# EAGLE design piezo-layer_v0.1-R002 (EAGLE 6.5.0)
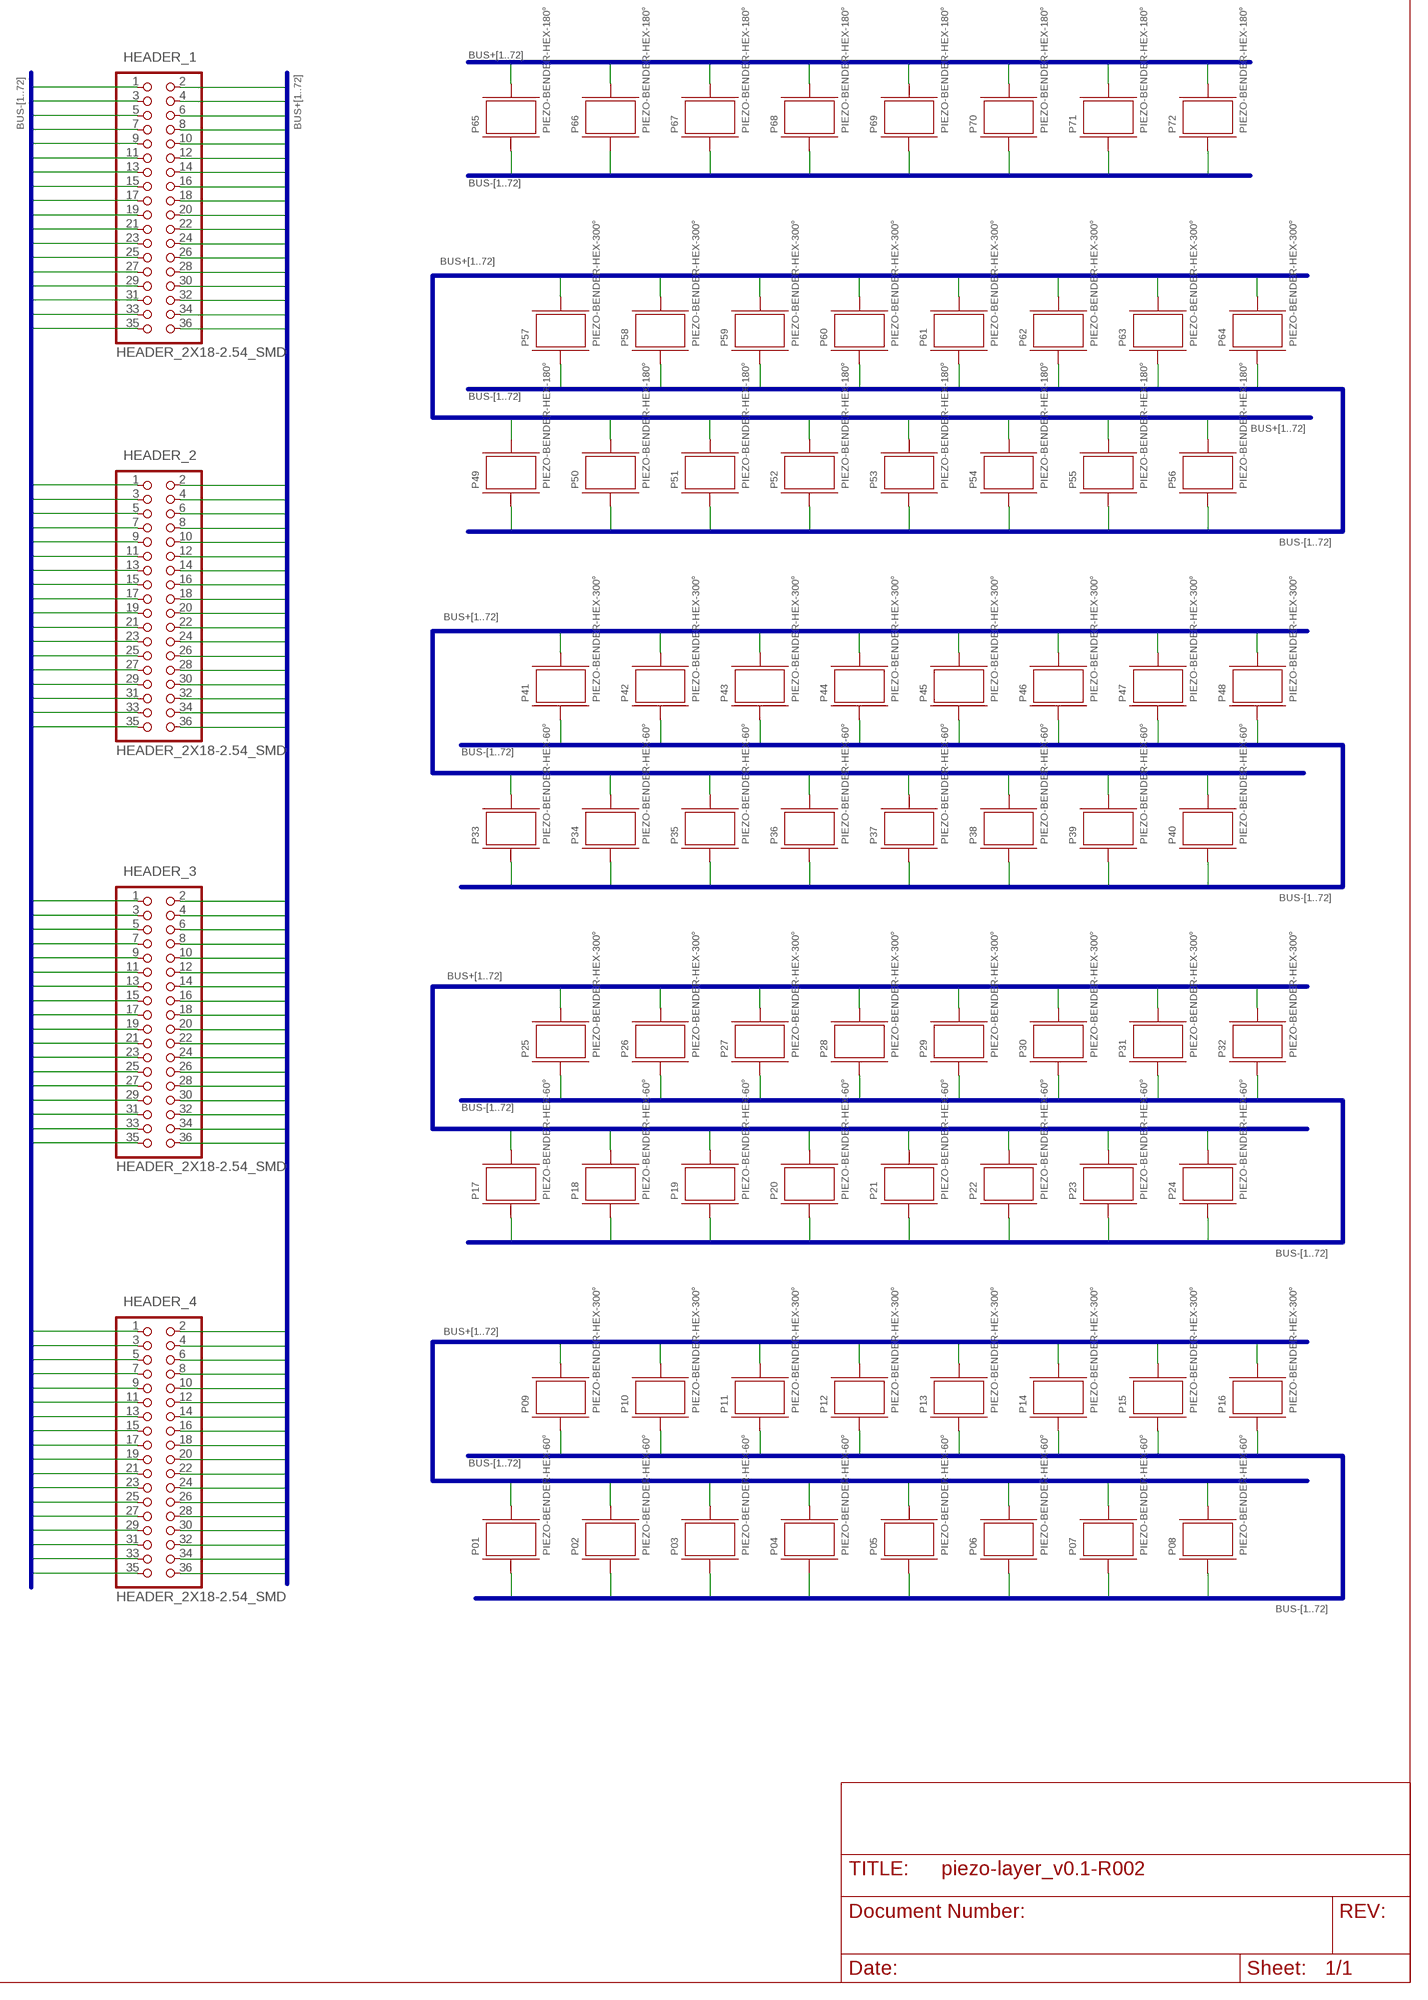
[diagram p0: schematic, sheet 1]

## Parts
HEADER_1  HEADER_2X18-2.54_SMD  [2X18_2.54_SMD]
HEADER_2  HEADER_2X18-2.54_SMD  [2X18_2.54_SMD]
HEADER_3  HEADER_2X18-2.54_SMD  [2X18_2.54_SMD]
HEADER_4  HEADER_2X18-2.54_SMD  [2X18_2.54_SMD]
P01  PIEZO-BENDER-HEX-60°  [PIEZO-BENDER-HEX_16MM_60°]
P02  PIEZO-BENDER-HEX-60°  [PIEZO-BENDER-HEX_16MM_60°]
P03  PIEZO-BENDER-HEX-60°  [PIEZO-BENDER-HEX_16MM_60°]
P04  PIEZO-BENDER-HEX-60°  [PIEZO-BENDER-HEX_16MM_60°]
P05  PIEZO-BENDER-HEX-60°  [PIEZO-BENDER-HEX_16MM_60°]
P06  PIEZO-BENDER-HEX-60°  [PIEZO-BENDER-HEX_16MM_60°]
P07  PIEZO-BENDER-HEX-60°  [PIEZO-BENDER-HEX_16MM_60°]
P08  PIEZO-BENDER-HEX-60°  [PIEZO-BENDER-HEX_16MM_60°]
P09  PIEZO-BENDER-HEX-300°  [PIEZO-BENDER-HEX_16MM_300°]
P10  PIEZO-BENDER-HEX-300°  [PIEZO-BENDER-HEX_16MM_300°]
P11  PIEZO-BENDER-HEX-300°  [PIEZO-BENDER-HEX_16MM_300°]
P12  PIEZO-BENDER-HEX-300°  [PIEZO-BENDER-HEX_16MM_300°]
P13  PIEZO-BENDER-HEX-300°  [PIEZO-BENDER-HEX_16MM_300°]
P14  PIEZO-BENDER-HEX-300°  [PIEZO-BENDER-HEX_16MM_300°]
P15  PIEZO-BENDER-HEX-300°  [PIEZO-BENDER-HEX_16MM_300°]
P16  PIEZO-BENDER-HEX-300°  [PIEZO-BENDER-HEX_16MM_300°]
P17  PIEZO-BENDER-HEX-60°  [PIEZO-BENDER-HEX_16MM_60°]
P18  PIEZO-BENDER-HEX-60°  [PIEZO-BENDER-HEX_16MM_60°]
P19  PIEZO-BENDER-HEX-60°  [PIEZO-BENDER-HEX_16MM_60°]
P20  PIEZO-BENDER-HEX-60°  [PIEZO-BENDER-HEX_16MM_60°]
P21  PIEZO-BENDER-HEX-60°  [PIEZO-BENDER-HEX_16MM_60°]
P22  PIEZO-BENDER-HEX-60°  [PIEZO-BENDER-HEX_16MM_60°]
P23  PIEZO-BENDER-HEX-60°  [PIEZO-BENDER-HEX_16MM_60°]
P24  PIEZO-BENDER-HEX-60°  [PIEZO-BENDER-HEX_16MM_60°]
P25  PIEZO-BENDER-HEX-300°  [PIEZO-BENDER-HEX_16MM_300°]
P26  PIEZO-BENDER-HEX-300°  [PIEZO-BENDER-HEX_16MM_300°]
P27  PIEZO-BENDER-HEX-300°  [PIEZO-BENDER-HEX_16MM_300°]
P28  PIEZO-BENDER-HEX-300°  [PIEZO-BENDER-HEX_16MM_300°]
P29  PIEZO-BENDER-HEX-300°  [PIEZO-BENDER-HEX_16MM_300°]
P30  PIEZO-BENDER-HEX-300°  [PIEZO-BENDER-HEX_16MM_300°]
P31  PIEZO-BENDER-HEX-300°  [PIEZO-BENDER-HEX_16MM_300°]
P32  PIEZO-BENDER-HEX-300°  [PIEZO-BENDER-HEX_16MM_300°]
P33  PIEZO-BENDER-HEX-60°  [PIEZO-BENDER-HEX_16MM_60°]
P34  PIEZO-BENDER-HEX-60°  [PIEZO-BENDER-HEX_16MM_60°]
P35  PIEZO-BENDER-HEX-60°  [PIEZO-BENDER-HEX_16MM_60°]
P36  PIEZO-BENDER-HEX-60°  [PIEZO-BENDER-HEX_16MM_60°]
P37  PIEZO-BENDER-HEX-60°  [PIEZO-BENDER-HEX_16MM_60°]
P38  PIEZO-BENDER-HEX-60°  [PIEZO-BENDER-HEX_16MM_60°]
P39  PIEZO-BENDER-HEX-60°  [PIEZO-BENDER-HEX_16MM_60°]
P40  PIEZO-BENDER-HEX-60°  [PIEZO-BENDER-HEX_16MM_60°]
P41  PIEZO-BENDER-HEX-300°  [PIEZO-BENDER-HEX_16MM_300°]
P42  PIEZO-BENDER-HEX-300°  [PIEZO-BENDER-HEX_16MM_300°]
P43  PIEZO-BENDER-HEX-300°  [PIEZO-BENDER-HEX_16MM_300°]
P44  PIEZO-BENDER-HEX-300°  [PIEZO-BENDER-HEX_16MM_300°]
P45  PIEZO-BENDER-HEX-300°  [PIEZO-BENDER-HEX_16MM_300°]
P46  PIEZO-BENDER-HEX-300°  [PIEZO-BENDER-HEX_16MM_300°]
P47  PIEZO-BENDER-HEX-300°  [PIEZO-BENDER-HEX_16MM_300°]
P48  PIEZO-BENDER-HEX-300°  [PIEZO-BENDER-HEX_16MM_300°]
P49  PIEZO-BENDER-HEX-180°  [PIEZO-BENDER-HEX_16MM_180°]
P50  PIEZO-BENDER-HEX-180°  [PIEZO-BENDER-HEX_16MM_180°]
P51  PIEZO-BENDER-HEX-180°  [PIEZO-BENDER-HEX_16MM_180°]
P52  PIEZO-BENDER-HEX-180°  [PIEZO-BENDER-HEX_16MM_180°]
P53  PIEZO-BENDER-HEX-180°  [PIEZO-BENDER-HEX_16MM_180°]
P54  PIEZO-BENDER-HEX-180°  [PIEZO-BENDER-HEX_16MM_180°]
P55  PIEZO-BENDER-HEX-180°  [PIEZO-BENDER-HEX_16MM_180°]
P56  PIEZO-BENDER-HEX-180°  [PIEZO-BENDER-HEX_16MM_180°]
P57  PIEZO-BENDER-HEX-300°  [PIEZO-BENDER-HEX_16MM_300°]
P58  PIEZO-BENDER-HEX-300°  [PIEZO-BENDER-HEX_16MM_300°]
P59  PIEZO-BENDER-HEX-300°  [PIEZO-BENDER-HEX_16MM_300°]
P60  PIEZO-BENDER-HEX-300°  [PIEZO-BENDER-HEX_16MM_300°]
P61  PIEZO-BENDER-HEX-300°  [PIEZO-BENDER-HEX_16MM_300°]
P62  PIEZO-BENDER-HEX-300°  [PIEZO-BENDER-HEX_16MM_300°]
P63  PIEZO-BENDER-HEX-300°  [PIEZO-BENDER-HEX_16MM_300°]
P64  PIEZO-BENDER-HEX-300°  [PIEZO-BENDER-HEX_16MM_300°]
P65  PIEZO-BENDER-HEX-180°  [PIEZO-BENDER-HEX_16MM_180°]
P66  PIEZO-BENDER-HEX-180°  [PIEZO-BENDER-HEX_16MM_180°]
P67  PIEZO-BENDER-HEX-180°  [PIEZO-BENDER-HEX_16MM_180°]
P68  PIEZO-BENDER-HEX-180°  [PIEZO-BENDER-HEX_16MM_180°]
P69  PIEZO-BENDER-HEX-180°  [PIEZO-BENDER-HEX_16MM_180°]
P70  PIEZO-BENDER-HEX-180°  [PIEZO-BENDER-HEX_16MM_180°]
P71  PIEZO-BENDER-HEX-180°  [PIEZO-BENDER-HEX_16MM_180°]
P72  PIEZO-BENDER-HEX-180°  [PIEZO-BENDER-HEX_16MM_180°]

## Nets
BUS+1: HEADER_1.18 P01.TIP1(+_1)
BUS+2: HEADER_1.36 P02.TIP1(+_1)
BUS+3: HEADER_2.18 P03.TIP1(+_1)
BUS+4: HEADER_2.36 P04.TIP1(+_1)
BUS+5: HEADER_3.18 P05.TIP1(+_1)
BUS+6: HEADER_3.36 P06.TIP1(+_1)
BUS+7: HEADER_4.18 P07.TIP1(+_1)
BUS+8: HEADER_4.36 P08.TIP1(+_1)
BUS+9: HEADER_1.16 P09.TIP1(+_1)
BUS+10: HEADER_1.34 P10.TIP1(+_1)
BUS+11: HEADER_2.16 P11.TIP1(+_1)
BUS+12: HEADER_2.34 P12.TIP1(+_1)
BUS+13: HEADER_3.16 P13.TIP1(+_1)
BUS+14: HEADER_3.34 P14.TIP1(+_1)
BUS+15: HEADER_4.16 P15.TIP1(+_1)
BUS+16: HEADER_4.34 P16.TIP1(+_1)
BUS+17: HEADER_1.14 P17.TIP1(+_1)
BUS+18: HEADER_1.32 P18.TIP1(+_1)
BUS+19: HEADER_2.14 P19.TIP1(+_1)
BUS+20: HEADER_2.32 P20.TIP1(+_1)
BUS+21: HEADER_3.14 P21.TIP1(+_1)
BUS+22: HEADER_3.32 P22.TIP1(+_1)
BUS+23: HEADER_4.14 P23.TIP1(+_1)
BUS+24: HEADER_4.32 P24.TIP1(+_1)
BUS+25: HEADER_1.12 P25.TIP1(+_1)
BUS+26: HEADER_1.30 P26.TIP1(+_1)
BUS+27: HEADER_2.12 P27.TIP1(+_1)
BUS+28: HEADER_2.30 P28.TIP1(+_1)
BUS+29: HEADER_3.12 P29.TIP1(+_1)
BUS+30: HEADER_3.30 P30.TIP1(+_1)
BUS+31: HEADER_4.12 P31.TIP1(+_1)
BUS+32: HEADER_4.30 P32.TIP1(+_1)
BUS+33: HEADER_1.10 P33.TIP1(+_1)
BUS+34: HEADER_1.28 P34.TIP1(+_1)
BUS+35: HEADER_2.10 P35.TIP1(+_1)
BUS+36: HEADER_2.28 P36.TIP1(+_1)
BUS+37: HEADER_3.10 P37.TIP1(+_1)
BUS+38: HEADER_3.28 P38.TIP1(+_1)
BUS+39: HEADER_4.10 P39.TIP1(+_1)
BUS+40: HEADER_4.28 P40.TIP1(+_1)
BUS+41: HEADER_1.8 P41.TIP1(+_1)
BUS+42: HEADER_1.26 P42.TIP1(+_1)
BUS+43: HEADER_2.8 P43.TIP1(+_1)
BUS+44: HEADER_2.26 P44.TIP1(+_1)
BUS+45: HEADER_3.8 P45.TIP1(+_1)
BUS+46: HEADER_3.26 P46.TIP1(+_1)
BUS+47: HEADER_4.8 P47.TIP1(+_1)
BUS+48: HEADER_4.26 P48.TIP1(+_1)
BUS+49: HEADER_1.6 P49.TIP1(+_1)
BUS+50: HEADER_1.24 P50.TIP1(+_1)
BUS+51: HEADER_2.6 P51.TIP1(+_1)
BUS+52: HEADER_2.24 P52.TIP1(+_1)
BUS+53: HEADER_3.6 P53.TIP1(+_1)
BUS+54: HEADER_3.24 P54.TIP1(+_1)
BUS+55: HEADER_4.6 P55.TIP1(+_1)
BUS+56: HEADER_4.24 P56.TIP1(+_1)
BUS+57: HEADER_1.4 P57.TIP1(+_1)
BUS+58: HEADER_1.22 P58.TIP1(+_1)
BUS+59: HEADER_2.4 P59.TIP1(+_1)
BUS+60: HEADER_2.22 P60.TIP1(+_1)
BUS+61: HEADER_3.4 P61.TIP1(+_1)
BUS+62: HEADER_3.22 P62.TIP1(+_1)
BUS+63: HEADER_4.4 P63.TIP1(+_1)
BUS+64: HEADER_4.22 P64.TIP1(+_1)
BUS+65: HEADER_1.2 P65.TIP1(+_1)
BUS+66: HEADER_1.20 P66.TIP1(+_1)
BUS+67: HEADER_2.2 P67.TIP1(+_1)
BUS+68: HEADER_2.20 P68.TIP1(+_1)
BUS+69: HEADER_3.2 P69.TIP1(+_1)
BUS+70: HEADER_3.20 P70.TIP1(+_1)
BUS+71: HEADER_4.2 P71.TIP1(+_1)
BUS+72: HEADER_4.20 P72.TIP1(+_1)
BUS-1: HEADER_1.17 P01.PAD1(-_1)
BUS-2: HEADER_1.35 P02.PAD1(-_1)
BUS-3: HEADER_2.17 P03.PAD1(-_1)
BUS-4: HEADER_2.35 P04.PAD1(-_1)
BUS-5: HEADER_3.17 P05.PAD1(-_1)
BUS-6: HEADER_3.35 P06.PAD1(-_1)
BUS-7: HEADER_4.17 P07.PAD1(-_1)
BUS-8: HEADER_4.35 P08.PAD1(-_1)
BUS-9: HEADER_1.15 P09.PAD1(-_1)
BUS-10: HEADER_1.33 P10.PAD1(-_1)
BUS-11: HEADER_2.15 P11.PAD1(-_1)
BUS-12: HEADER_2.33 P12.PAD1(-_1)
BUS-13: HEADER_3.15 P13.PAD1(-_1)
BUS-14: HEADER_3.33 P14.PAD1(-_1)
BUS-15: HEADER_4.15 P15.PAD1(-_1)
BUS-16: HEADER_4.33 P16.PAD1(-_1)
BUS-17: HEADER_1.13 P17.PAD1(-_1)
BUS-18: HEADER_1.31 P18.PAD1(-_1)
BUS-19: HEADER_2.13 P19.PAD1(-_1)
BUS-20: HEADER_2.31 P20.PAD1(-_1)
BUS-21: HEADER_3.13 P21.PAD1(-_1)
BUS-22: HEADER_3.31 P22.PAD1(-_1)
BUS-23: HEADER_4.13 P23.PAD1(-_1)
BUS-24: HEADER_4.31 P24.PAD1(-_1)
BUS-25: HEADER_1.11 P25.PAD1(-_1)
BUS-26: HEADER_1.29 P26.PAD1(-_1)
BUS-27: HEADER_2.11 P27.PAD1(-_1)
BUS-28: HEADER_2.29 P28.PAD1(-_1)
BUS-29: HEADER_3.11 P29.PAD1(-_1)
BUS-30: HEADER_3.29 P30.PAD1(-_1)
BUS-31: HEADER_4.11 P31.PAD1(-_1)
BUS-32: HEADER_4.29 P32.PAD1(-_1)
BUS-33: HEADER_1.9 P33.PAD1(-_1)
BUS-34: HEADER_1.27 P34.PAD1(-_1)
BUS-35: HEADER_2.9 P35.PAD1(-_1)
BUS-36: HEADER_2.27 P36.PAD1(-_1)
BUS-37: HEADER_3.9 P37.PAD1(-_1)
BUS-38: HEADER_3.27 P38.PAD1(-_1)
BUS-39: HEADER_4.9 P39.PAD1(-_1)
BUS-40: HEADER_4.27 P40.PAD1(-_1)
BUS-41: HEADER_1.7 P41.PAD1(-_1)
BUS-42: HEADER_1.25 P42.PAD1(-_1)
BUS-43: HEADER_2.7 P43.PAD1(-_1)
BUS-44: HEADER_2.25 P44.PAD1(-_1)
BUS-45: HEADER_3.7 P45.PAD1(-_1)
BUS-46: HEADER_3.25 P46.PAD1(-_1)
BUS-47: HEADER_4.7 P47.PAD1(-_1)
BUS-48: HEADER_4.25 P48.PAD1(-_1)
BUS-49: HEADER_1.5 P49.PAD1(-_1)
BUS-50: HEADER_1.23 P50.PAD1(-_1)
BUS-51: HEADER_2.5 P51.PAD1(-_1)
BUS-52: HEADER_2.23 P52.PAD1(-_1)
BUS-53: HEADER_3.5 P53.PAD1(-_1)
BUS-54: HEADER_3.23 P54.PAD1(-_1)
BUS-55: HEADER_4.5 P55.PAD1(-_1)
BUS-56: HEADER_4.23 P56.PAD1(-_1)
BUS-57: HEADER_1.3 P57.PAD1(-_1)
BUS-58: HEADER_1.21 P58.PAD1(-_1)
BUS-59: HEADER_2.3 P59.PAD1(-_1)
BUS-60: HEADER_2.21 P60.PAD1(-_1)
BUS-61: HEADER_3.3 P61.PAD1(-_1)
BUS-62: HEADER_3.21 P62.PAD1(-_1)
BUS-63: HEADER_4.3 P63.PAD1(-_1)
BUS-64: HEADER_4.21 P64.PAD1(-_1)
BUS-65: HEADER_1.1 P65.PAD1(-_1)
BUS-66: HEADER_1.19 P66.PAD1(-_1)
BUS-67: HEADER_2.1 P67.PAD1(-_1)
BUS-68: HEADER_2.19 P68.PAD1(-_1)
BUS-69: HEADER_3.1 P69.PAD1(-_1)
BUS-70: HEADER_3.19 P70.PAD1(-_1)
BUS-71: HEADER_4.1 P71.PAD1(-_1)
BUS-72: HEADER_4.19 P72.PAD1(-_1)

## Buses
BUS+[1..72]
BUS-[1..72]

## Library data of the parts
HEADER_1-HEADER_4 = SABRe:HEADER_2X18
P01-P09 P10-P72 = ICST:PIEZO-BENDER-HEX

## Board
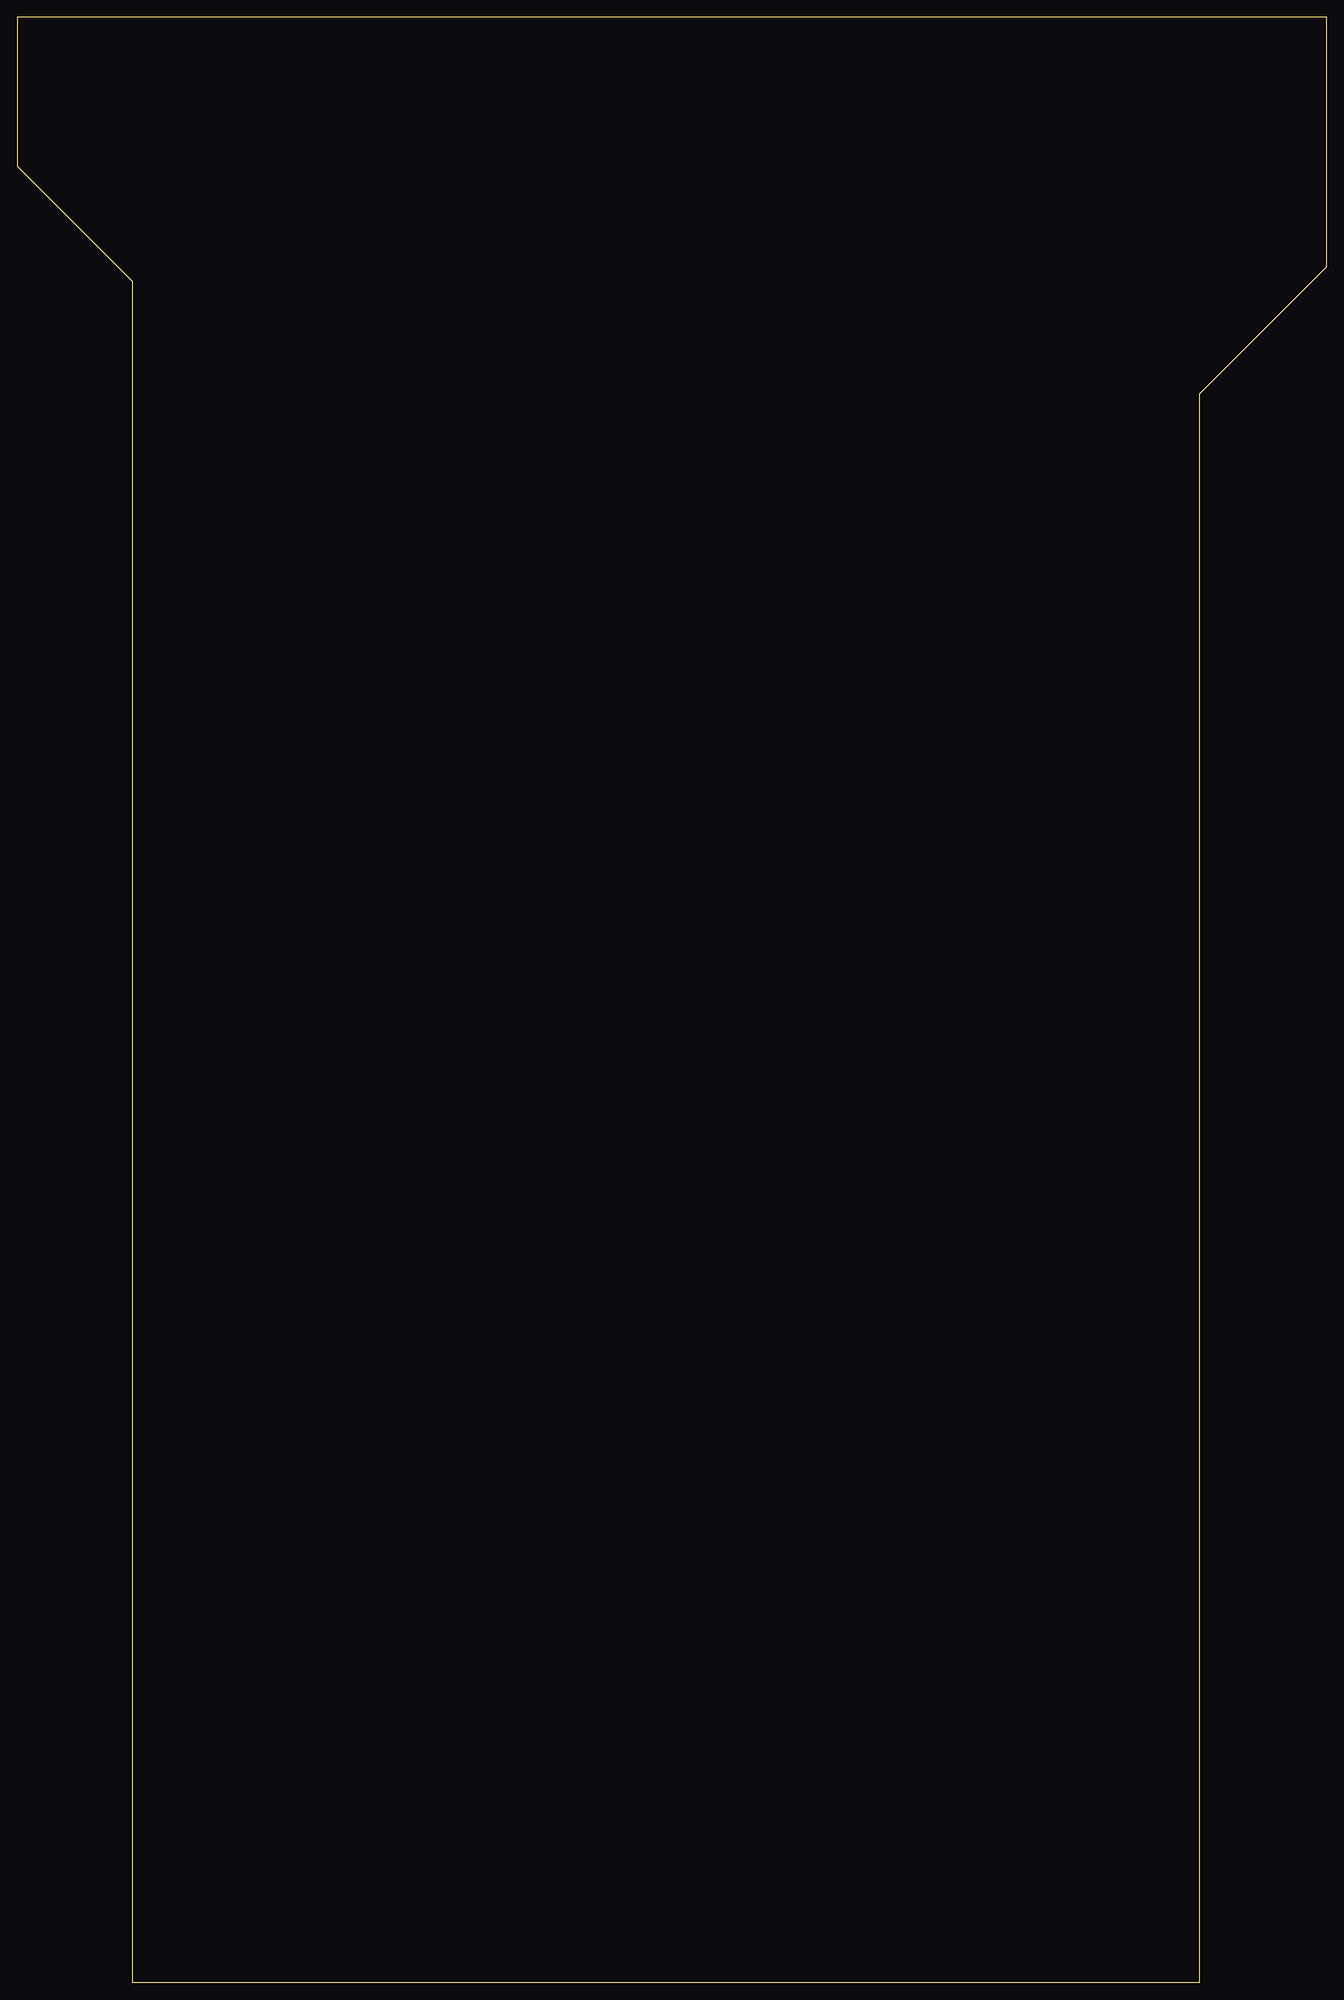
[diagram p1: board, top side]
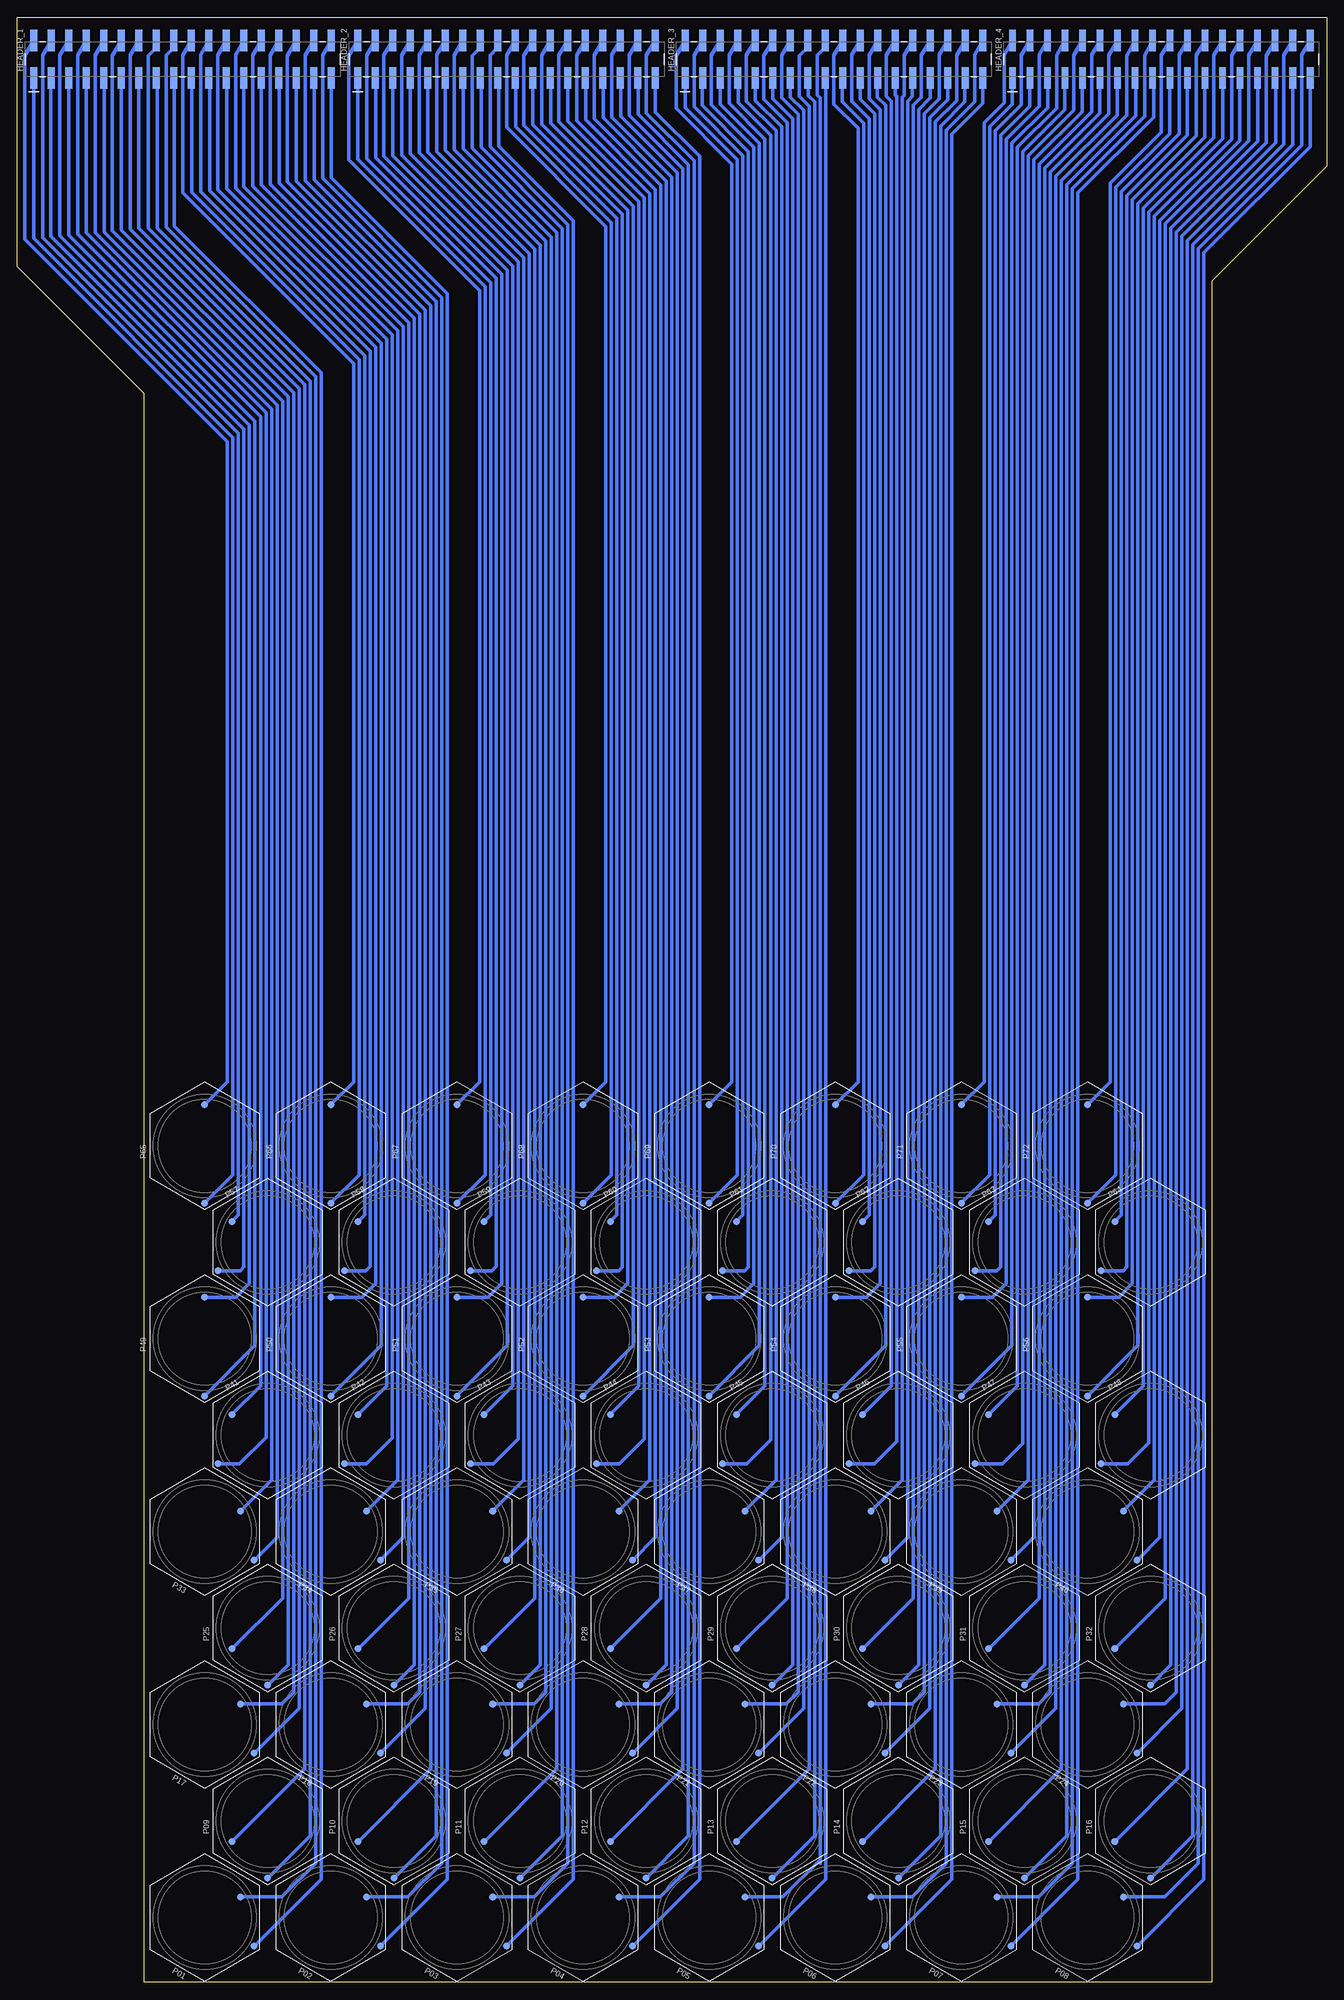
[diagram p2: board, bottom side, seen from below]

Size 190 x 285.2 mm. Coordinates in mm from the lower left corner, seen from the top.
Outline: 16.7,0 171.6,0 171.6,230.6 190,249 190,285.2 0,285.2 0,263.6 16.7,246.9 16.7,0
Copper layers 16: Bottom 0.035mm
Design rules "1L-0.2-0.15_0.3mm *": minimum track width 0.2mm, minimum drill 0.3mm, track to track 0.15mm, track to pad 0.15mm, pad to pad 0.15mm, via to via 0.15mm, smd to smd 0.15mm, copper to edge 0.5mm, drill to drill 1mm, minimum pad ring 10mil, minimum via ring 8mil, stop-mask expansion 4mil, vias tented up to drill 0mil, thermal gap 10mil

### Footprints (pad centres in the part's own frame; a part is rotated, then mirrored left to right if it is on the bottom)
2X18_2.54_SMD = smd 1 x 3.1: 1 -21.59,-2.7; 2 -21.59,2.7; 3 -19.05,-2.7; 4 -19.05,2.7; 5 -16.51,-2.7; 6 -16.51,2.7; 7 -13.97,-2.7; 8 -13.97,2.7; 9 -11.43,-2.7; 10 -11.43,2.7; 11 -8.89,-2.7; 12 -8.89,2.7; 13 -6.35,-2.7; 14 -6.35,2.7; 15 -3.81,-2.7; 16 -3.81,2.7; 17 -1.27,-2.7; 18 -1.27,2.7; 19 1.27,-2.7; 20 1.27,2.7; 21 3.81,-2.7; 22 3.81,2.7; 23 6.35,-2.7; 24 6.35,2.7; 25 8.89,-2.7; 26 8.89,2.7; 27 11.43,-2.7; 28 11.43,2.7; 29 13.97,-2.7; 30 13.97,2.7; 31 16.51,-2.7; 32 16.51,2.7; 33 19.05,-2.7; 34 19.05,2.7; 35 21.59,-2.7; 36 21.59,2.7
PIEZO-BENDER-HEX_16MM_60° = smd 1 x 1: PAD1 -8.3,0; TIP1 -3,-5.2
PIEZO-BENDER-HEX_16MM_300° = smd 1 x 1: PAD1 -8.3,0; TIP1 -3,5.2
PIEZO-BENDER-HEX_16MM_180° = smd 1 x 1: PAD1 -8.3,0; TIP1 6,0

### Placement (x,y rotation side)
HEADER_1  166,279.1 0 bottom
HEADER_2  119,279.1 0 bottom
HEADER_3  71.5,279.1 0 bottom
HEADER_4  24,279.1 0 bottom
P01  162.8,9.4 150 bottom
P02  144.5,9.4 150 bottom
P03  126.2,9.4 150 bottom
P04  107.9,9.4 150 bottom
P05  89.6,9.4 150 bottom
P06  71.3,9.4 150 bottom
P07  53,9.4 150 bottom
P08  34.7,9.4 150 bottom
P09  153.65,23.4 90 bottom
P10  135.35,23.4 90 bottom
P11  117.05,23.4 90 bottom
P12  98.75,23.4 90 bottom
P13  80.45,23.4 90 bottom
P14  62.15,23.4 90 bottom
P15  43.85,23.4 90 bottom
P16  25.55,23.4 90 bottom
P17  162.8,37.4 150 bottom
P18  144.5,37.4 150 bottom
P19  126.2,37.4 150 bottom
P20  107.9,37.4 150 bottom
P21  89.6,37.4 150 bottom
P22  71.3,37.4 150 bottom
P23  53,37.4 150 bottom
P24  34.7,37.4 150 bottom
P25  153.65,51.4 90 bottom
P26  135.35,51.4 90 bottom
P27  117.05,51.4 90 bottom
P28  98.75,51.4 90 bottom
P29  80.45,51.4 90 bottom
P30  62.15,51.4 90 bottom
P31  43.85,51.4 90 bottom
P32  25.55,51.4 90 bottom
P33  162.8,65.4 150 bottom
P34  144.5,65.4 150 bottom
P35  126.2,65.4 150 bottom
P36  107.9,65.4 150 bottom
P37  89.6,65.4 150 bottom
P38  71.3,65.4 150 bottom
P39  53,65.4 150 bottom
P40  34.7,65.4 150 bottom
P41  153.65,79.4 30 bottom
P42  135.35,79.4 30 bottom
P43  117.05,79.4 30 bottom
P44  98.75,79.4 30 bottom
P45  80.45,79.4 30 bottom
P46  62.15,79.4 30 bottom
P47  43.85,79.4 30 bottom
P48  25.55,79.4 30 bottom
P49  162.8,93.4 90 bottom
P50  144.5,93.4 90 bottom
P51  126.2,93.4 90 bottom
P52  107.9,93.4 90 bottom
P53  89.6,93.4 90 bottom
P54  71.3,93.4 90 bottom
P55  53,93.4 90 bottom
P56  34.7,93.4 90 bottom
P57  153.65,107.4 30 bottom
P58  135.35,107.4 30 bottom
P59  117.05,107.4 30 bottom
P60  98.75,107.4 30 bottom
P61  80.45,107.4 30 bottom
P62  62.15,107.4 30 bottom
P63  43.85,107.4 30 bottom
P64  25.55,107.4 30 bottom
P65  162.8,121.4 90 bottom
P66  144.5,121.4 90 bottom
P67  126.2,121.4 90 bottom
P68  107.9,121.4 90 bottom
P69  89.6,121.4 90 bottom
P70  71.3,121.4 90 bottom
P71  53,121.4 90 bottom
P72  34.7,121.4 90 bottom

### Tracks (layer width: path | path; a pad name or v marks a point on that pad's centre or on a via)
BUS+1
  Bottom 0.5: 167.14,280.94 167.24,280.84 | 167.24,280.84 168.4,279.68 168.4,254.7 146.7,233 146.7,17.3 151.6,12.4 P01.TIP1 | HEADER_1.18 167.24,280.91 167.24,280.84
BUS+2
  Bottom 0.5: HEADER_1.36 145.7,279.65 145.7,261.8 128.4,244.5 128.4,17.3 133.3,12.4 P02.TIP1
BUS+3
  Bottom 0.5: 120.14,280.94 120.24,280.84 | 120.24,280.84 121.4,279.68 121.4,266.4 110.1,255.1 110.1,17.3 115,12.4 P03.TIP1 | HEADER_2.18 120.24,280.91 120.24,280.84
BUS+4
  Bottom 0.5: HEADER_2.36 98.7,279.65 98.7,271.3 91.8,264.4 91.8,17.3 96.7,12.4 P04.TIP1
BUS+5
  Bottom 0.5: 72.64,280.94 72.69,280.89 | 72.69,280.89 73.9,279.68 73.9,273.9 73.5,273.5 73.5,17.8 | HEADER_3.18 72.72,280.89 72.69,280.89 | 73.5,17.8 73.5,17.3 | P05.TIP1 78.9,12.4 73.5,17.8
BUS+6
  Bottom 0.5: HEADER_3.36 51.1,279.75 51.1,272.9 55.2,268.8 55.2,17.3 60.1,12.4 P06.TIP1
BUS+7
  Bottom 0.5: HEADER_4.18 26.4,279.68 26.4,270.8 36.9,260.3 36.9,17.3 41.8,12.4 P07.TIP1
BUS+8
  Bottom 0.5: HEADER_4.36 3.6,279.75 3.6,266.6 18.6,251.6 18.6,17.3 23.5,12.4 P08.TIP1
BUS+9
  Bottom 0.5: HEADER_1.16 169.68,280.94 171,279.62 171,254.6 148.3,231.9 148.3,30.95 P09.TIP1
BUS+10
  Bottom 0.5: HEADER_1.34 148.2,279.69 148.2,261.5 130,243.3 130,30.95 P10.TIP1
BUS+11
  Bottom 0.5: HEADER_2.16 122.68,280.94 124,279.62 124,266.2 111.7,253.9 111.7,30.95 P11.TIP1
BUS+12
  Bottom 0.5: HEADER_2.34 101.2,279.69 101.2,271 93.4,263.2 93.4,30.95 P12.TIP1
BUS+13
  Bottom 0.5: HEADER_3.16 75.18,280.94 76.5,279.62 76.5,273.7 75.1,272.3 75.1,30.95 P13.TIP1
BUS+14
  Bottom 0.5: HEADER_3.34 53.7,279.69 53.7,273.1 56.8,270 56.8,30.95 P14.TIP1
BUS+15
  Bottom 0.5: HEADER_4.16 29,279.62 29,271 38.5,261.5 38.5,30.95 P15.TIP1
BUS+16
  Bottom 0.5: HEADER_4.34 6.2,279.69 6.2,266.8 20.2,252.8 20.2,30.95 P16.TIP1
BUS+17
  Bottom 0.5: HEADER_1.14 173.6,279.69 173.6,254.4 149.9,230.7 149.9,42.1 151.6,40.4 P17.TIP1
BUS+18
  Bottom 0.5: HEADER_1.32 150.8,279.63 150.8,261.3 131.6,242.1 131.6,42.1 133.3,40.4 P18.TIP1
BUS+19
  Bottom 0.5: HEADER_2.14 126.6,279.69 126.6,266 113.3,252.7 113.3,42.1 115,40.4 P19.TIP1
BUS+20
  Bottom 0.5: HEADER_2.32 103.7,279.73 103.7,270.7 95,262 95,42.1 96.7,40.4 P20.TIP1
BUS+21
  Bottom 0.5: HEADER_3.14 79.1,279.69 79.1,273.5 76.7,271.1 76.7,42.1 78.4,40.4 P21.TIP1
BUS+22
  Bottom 0.5: HEADER_3.32 56.2,279.73 56.2,273.4 58.4,271.2 58.4,42.1 60.1,40.4 P22.TIP1
BUS+23
  Bottom 0.5: HEADER_4.14 31.6,279.69 31.6,271.2 40.1,262.7 40.1,42.1 41.8,40.4 P23.TIP1
BUS+24
  Bottom 0.5: HEADER_4.32 8.8,279.63 8.8,267 21.8,254 21.8,42.1 23.5,40.4 P24.TIP1
BUS+25
  Bottom 0.5: HEADER_1.12 176.2,279.63 176.2,254.2 151.5,229.5 151.5,55.75 P25.TIP1
BUS+26
  Bottom 0.5: HEADER_1.30 153.3,279.67 153.3,261 133.2,240.9 133.2,55.75 P26.TIP1
BUS+27
  Bottom 0.5: HEADER_2.12 129.1,279.73 129.1,265.7 114.9,251.5 114.9,55.75 P27.TIP1
BUS+28
  Bottom 0.5: HEADER_2.30 106.3,279.67 106.3,270.5 96.6,260.8 96.6,55.75 P28.TIP1
BUS+29
  Bottom 0.5: HEADER_3.12 81.7,279.63 81.7,273.3 78.3,269.9 78.3,55.75 P29.TIP1
BUS+30
  Bottom 0.5: HEADER_3.30 58.8,279.67 58.8,273.6 60,272.4 60,55.75 P30.TIP1
BUS+31
  Bottom 0.5: HEADER_4.12 34.1,279.73 34.1,271.5 41.7,263.9 41.7,55.75 P31.TIP1
BUS+32
  Bottom 0.5: HEADER_4.30 11.3,279.67 11.3,267.3 23.4,255.2 23.4,55.75 P32.TIP1
BUS+33
  Bottom 0.5: HEADER_1.10 178.7,279.67 178.7,253.9 153.1,228.3 153.1,72.91 P33.TIP1
BUS+34
  Bottom 0.5: HEADER_1.28 155.8,279.71 155.8,260.7 134.8,239.7 134.8,72.91 P34.TIP1
BUS+35
  Bottom 0.5: HEADER_2.10 131.7,279.67 131.7,265.5 116.5,250.3 116.5,72.91 P35.TIP1
BUS+36
  Bottom 0.5: HEADER_2.28 108.8,279.71 108.8,270.2 98.2,259.6 98.2,72.91 P36.TIP1
BUS+37
  Bottom 0.5: HEADER_3.10 84.2,279.67 84.2,273 79.9,268.7 79.9,72.91 P37.TIP1
BUS+38
  Bottom 0.5: HEADER_3.28 61.3,279.71 61.3,273.9 61.6,273.6 61.6,72.91 P38.TIP1
BUS+39
  Bottom 0.5: HEADER_4.10 36.7,279.67 36.7,271.7 43.3,265.1 43.3,72.91 P39.TIP1
BUS+40
  Bottom 0.5: HEADER_4.28 13.8,279.71 13.8,267.5 25,256.3 25,72.91 P40.TIP1
BUS+41
  Bottom 0.5: HEADER_1.8 181.2,279.71 181.2,253.7 154.7,227.2 154.7,86.55 P41.TIP1
BUS+42
  Bottom 0.5: HEADER_1.26 158.3,279.75 158.3,260.4 136.4,238.5 136.4,86.55 P42.TIP1
BUS+43
  Bottom 0.5: HEADER_2.8 134.2,279.71 134.2,265.2 118.1,249.1 118.1,86.55 P43.TIP1
BUS+44
  Bottom 0.5: HEADER_2.26 111.4,279.65 111.4,270 99.8,258.4 99.8,86.55 P44.TIP1
BUS+45
  Bottom 0.5: HEADER_3.8 86.7,279.71 86.7,272.7 81.5,267.5 81.5,86.55 P45.TIP1
BUS+46
  Bottom 0.5: HEADER_3.26 63.9,279.65 63.9,273.7 63.2,273 63.2,86.55 P46.TIP1
BUS+47
  Bottom 0.5: HEADER_4.8 39.2,279.71 39.2,272 44.9,266.3 44.9,86.55 P47.TIP1
BUS+48
  Bottom 0.5: HEADER_4.26 16.4,279.65 16.4,267.7 26.6,257.5 26.6,86.55 P48.TIP1
BUS+49
  Bottom 0.5: HEADER_1.6 183.8,279.65 183.8,253.5 156.3,226 156.3,101.4 158.3,99.4 P49.TIP1
BUS+50
  Bottom 0.5: HEADER_1.24 160.9,279.69 160.9,260.2 138,237.3 138,101.4 140,99.4 P50.TIP1
BUS+51
  Bottom 0.5: HEADER_2.6 136.8,279.65 136.8,265 119.7,247.9 119.7,101.4 121.7,99.4 P51.TIP1
BUS+52
  Bottom 0.5: HEADER_2.24 113.9,279.69 113.9,269.7 101.4,257.2 101.4,101.4 103.4,99.4 P52.TIP1
BUS+53
  Bottom 0.5: HEADER_3.6 89.3,279.65 89.3,272.5 83.1,266.3 83.1,101.4 85.1,99.4 P53.TIP1
BUS+54
  Bottom 0.5: HEADER_3.24 66.4,279.69 66.4,273.4 64.8,271.8 64.8,101.4 66.8,99.4 P54.TIP1
BUS+55
  Bottom 0.5: HEADER_4.6 41.7,279.75 41.7,272.3 46.5,267.5 46.5,101.4 48.5,99.4 P55.TIP1
BUS+56
  Bottom 0.5: HEADER_4.24 18.9,279.69 18.9,268 28.2,258.7 28.2,101.4 30.2,99.4 P56.TIP1
BUS+57
  Bottom 0.5: HEADER_1.4 186.3,279.69 186.3,253.2 157.9,224.8 157.9,111.35 P57.TIP1
BUS+58
  Bottom 0.5: HEADER_1.22 163.4,279.73 163.4,259.9 139.6,236.1 139.6,111.35 P58.TIP1
BUS+59
  Bottom 0.5: HEADER_2.4 139.3,279.69 139.3,264.7 121.3,246.7 121.3,111.35 P59.TIP1
BUS+60
  Bottom 0.5: HEADER_2.22 116.5,279.63 116.5,269.5 103,256 103,111.35 P60.TIP1
BUS+61
  Bottom 0.5: HEADER_3.4 91.8,279.69 91.8,272.2 84.7,265.1 84.7,111.35 P61.TIP1
BUS+62
  Bottom 0.5: HEADER_3.22 68.9,279.73 68.9,273 66.4,270.5 66.4,111.35 P62.TIP1
BUS+63
  Bottom 0.5: HEADER_4.4 44.3,279.69 44.3,272.5 48.1,268.7 48.1,111.35 P63.TIP1
BUS+64
  Bottom 0.5: HEADER_4.22 21.4,279.73 21.4,268.3 29.8,259.9 29.8,111.35 P64.TIP1
BUS+65
  Bottom 0.5: HEADER_1.2 188.9,279.63 188.9,253 159.5,223.6 159.5,130.7 P65.TIP1
BUS+66
  Bottom 0.5: HEADER_1.20 166,279.67 166,259.7 141.2,234.9 141.2,130.7 P66.TIP1
BUS+67
  Bottom 0.5: HEADER_2.2 141.9,279.63 141.9,264.5 122.9,245.5 122.9,130.7 P67.TIP1
BUS+68
  Bottom 0.5: HEADER_2.20 119,279.67 119,269.2 104.6,254.8 104.6,130.7 P68.TIP1
BUS+69
  Bottom 0.5: HEADER_3.2 94.4,279.63 94.4,272 86.3,263.9 86.3,130.7 P69.TIP1
BUS+70
  Bottom 0.5: HEADER_3.20 71.5,279.67 71.5,272.6 68,269.1 68,130.7 P70.TIP1
BUS+71
  Bottom 0.5: HEADER_4.2 46.8,279.73 46.8,272.8 49.7,269.9 49.7,130.7 P71.TIP1
BUS+72
  Bottom 0.5: HEADER_4.20 24,279.67 24,268.5 31.4,261.1 31.4,130.7 P72.TIP1
BUS-1
  Bottom 0.5: P01.PAD1 145.9,14.96 145.9,233.6 167.2,254.9 167.2,277.2 | 167.14,277.26 167.2,277.2 | 167.2,277.2 167.26,277.26 HEADER_1.17
BUS-2
  Bottom 0.5: P02.PAD1 127.6,14.96 127.6,245.1 144.4,261.9 144.4,277.25 HEADER_1.35
BUS-3
  Bottom 0.5: P03.PAD1 109.3,14.96 109.3,255.7 120.1,266.5 120.1,277.22 120.14,277.26 HEADER_2.17
BUS-4
  Bottom 0.5: P04.PAD1 91,14.96 91,265 97.4,271.4 97.4,277.25 HEADER_2.35
BUS-5
  Bottom 0.5: P05.PAD1 72.7,14.96 72.7,277.2 | 72.64,277.26 72.7,277.2 | 72.7,277.2 72.76,277.26 HEADER_3.17
BUS-6
  Bottom 0.5: P06.PAD1 54.4,14.96 54.4,268.2 49.9,272.7 49.9,277.25 HEADER_3.35
BUS-7
  Bottom 0.5: P07.PAD1 36.1,14.96 36.1,259.7 25.1,270.7 25.1,277.22 HEADER_4.17
BUS-8
  Bottom 0.5: P08.PAD1 17.8,14.96 17.8,251 2.4,266.4 2.4,277.25 HEADER_4.35
BUS-9
  Bottom 0.5: P09.PAD1 147.5,21.25 147.5,232.4 169.7,254.6 169.7,277.15 | 169.68,277.26 169.7,277.24 169.7,277.15 | HEADER_1.15 169.7,277.15
BUS-10
  Bottom 0.5: P10.PAD1 129.2,21.25 129.2,243.9 146.9,261.6 146.9,277.21 HEADER_1.33
BUS-11
  Bottom 0.5: P11.PAD1 110.9,21.25 110.9,254.5 122.7,266.3 122.7,277.15 | 122.68,277.26 122.7,277.24 122.7,277.15 | HEADER_2.15 122.7,277.15
BUS-12
  Bottom 0.5: P12.PAD1 92.6,21.25 92.6,263.8 99.9,271.1 99.9,277.21 HEADER_2.33
BUS-13
  Bottom 0.5: P13.PAD1 74.3,21.25 74.3,272.9 75.2,273.8 75.2,277.15 | 75.18,277.26 75.2,277.24 75.2,277.15 | HEADER_3.15 75.2,277.15
BUS-14
  Bottom 0.5: P14.PAD1 56,21.25 56,269.4 52.5,272.9 52.5,277.21 HEADER_3.33
BUS-15
  Bottom 0.5: P15.PAD1 37.7,21.25 37.7,260.9 27.7,270.9 27.7,277.24 HEADER_4.15
BUS-16
  Bottom 0.5: P16.PAD1 19.4,21.25 19.4,252.2 4.9,266.7 4.9,277.21 HEADER_4.33
BUS-17
  Bottom 0.5: P17.PAD1 149.1,39.76 149.1,231.3 172.4,254.6 172.4,277.21 HEADER_1.13
BUS-18
  Bottom 0.5: P18.PAD1 130.8,39.76 130.8,242.7 149.5,261.4 149.5,277.25 HEADER_1.31
BUS-19
  Bottom 0.5: P19.PAD1 112.5,39.76 112.5,253.3 125.3,266.1 125.3,277.21 HEADER_2.13
BUS-20
  Bottom 0.5: P20.PAD1 94.2,39.76 94.2,262.6 102.4,270.8 102.4,277.17 HEADER_2.31
BUS-21
  Bottom 0.5: P21.PAD1 75.9,39.76 75.9,271.7 77.8,273.6 77.8,277.21 HEADER_3.13
BUS-22
  Bottom 0.5: P22.PAD1 57.6,39.76 57.6,270.6 55,273.2 55,277.25 HEADER_3.31
BUS-23
  Bottom 0.5: P23.PAD1 39.3,39.76 39.3,262.1 30.4,271 30.4,277.21 HEADER_4.13
BUS-24
  Bottom 0.5: P24.PAD1 21,39.76 21,253.4 7.4,267 7.4,277.17 HEADER_4.31
BUS-25
  Bottom 0.5: P25.PAD1 150.7,46.05 150.7,230.1 174.9,254.3 174.9,277.25 HEADER_1.11
BUS-26
  Bottom 0.5: P26.PAD1 132.4,46.05 132.4,241.5 152,261.1 152,277.23 HEADER_1.29
BUS-27
  Bottom 0.5: P27.PAD1 114.1,46.05 114.1,252.1 127.9,265.9 127.9,277.25 HEADER_2.11
BUS-28
  Bottom 0.5: P28.PAD1 95.8,46.05 95.8,261.4 105,270.6 105,277.23 HEADER_2.29
BUS-29
  Bottom 0.5: P29.PAD1 77.5,46.05 77.5,270.5 80.4,273.4 80.4,277.25 HEADER_3.11
BUS-30
  Bottom 0.5: P30.PAD1 59.2,46.05 59.2,271.8 57.5,273.5 57.5,277.23 HEADER_3.29
BUS-31
  Bottom 0.5: P31.PAD1 40.9,46.05 40.9,263.3 32.9,271.3 32.9,277.25 HEADER_4.11
BUS-32
  Bottom 0.5: P32.PAD1 22.6,46.05 22.6,254.6 10,267.2 10,277.23 HEADER_4.29
BUS-33
  Bottom 0.5: P33.PAD1 152.3,64.56 152.3,228.9 177.4,254 177.4,277.23 HEADER_1.9
BUS-34
  Bottom 0.5: P34.PAD1 134,64.56 134,240.3 154.6,260.9 154.6,277.23 HEADER_1.27
BUS-35
  Bottom 0.5: P35.PAD1 115.7,64.56 115.7,250.9 130.4,265.6 130.4,277.23 HEADER_2.9
BUS-36
  Bottom 0.5: P36.PAD1 97.4,64.56 97.4,260.2 107.5,270.3 107.5,277.19 HEADER_2.27
BUS-37
  Bottom 0.5: P37.PAD1 79.1,64.56 79.1,269.3 82.9,273.1 82.9,277.23 HEADER_3.9
BUS-38
  Bottom 0.5: P38.PAD1 60.8,64.56 60.8,273 60.1,273.7 60.1,277.23 HEADER_3.27
BUS-39
  Bottom 0.5: P39.PAD1 42.5,64.56 42.5,264.5 35.5,271.5 35.5,277.19 HEADER_4.9
BUS-40
  Bottom 0.5: P40.PAD1 24.2,64.56 24.2,255.7 12.6,267.3 12.6,277.23 HEADER_4.27
BUS-41
  Bottom 0.5: P41.PAD1 157.75,75.25 153.9,79.1 153.9,227.8 180,253.9 180,277.23 HEADER_1.7
BUS-42
  Bottom 0.5: P42.PAD1 139.35,75.25 135.6,79 135.6,239.1 157.1,260.6 157.1,277.25 HEADER_1.25
BUS-43
  Bottom 0.5: P43.PAD1 120.95,75.25 117.3,78.9 117.3,249.7 133,265.4 133,277.23 HEADER_2.7
BUS-44
  Bottom 0.5: P44.PAD1 102.65,75.25 99,78.9 99,259 110.1,270.1 110.1,277.25 HEADER_2.25
BUS-45
  Bottom 0.5: P45.PAD1 84.15,75.25 80.7,78.7 80.7,268.1 85.4,272.8 85.4,277.19 HEADER_3.7
BUS-46
  Bottom 0.5: P46.PAD1 65.65,75.25 62.4,78.5 62.4,273.7 62.6,273.9 62.6,277.25 HEADER_3.25
BUS-47
  Bottom 0.5: P47.PAD1 47.05,75.25 44.1,78.2 44.1,265.7 38,271.8 38,277.23 HEADER_4.7
BUS-48
  Bottom 0.5: P48.PAD1 28.85,75.25 25.8,78.3 25.8,256.9 15.1,267.6 15.1,277.25 HEADER_4.25
BUS-49
  Bottom 0.5: P49.PAD1 155.5,92.4 155.5,226.6 182.5,253.6 182.5,277.25 HEADER_1.5
BUS-50
  Bottom 0.5: P50.PAD1 137.2,92.4 137.2,237.9 159.6,260.3 159.6,277.21 HEADER_1.23
BUS-51
  Bottom 0.5: P51.PAD1 118.9,92.4 118.9,248.5 135.5,265.1 135.5,277.25 HEADER_2.5
BUS-52
  Bottom 0.5: P52.PAD1 100.6,92.4 100.6,257.8 112.6,269.8 112.6,277.21 HEADER_2.23
BUS-53
  Bottom 0.5: P53.PAD1 82.3,92.4 82.3,266.9 88,272.6 88,277.25 HEADER_3.5
BUS-54
  Bottom 0.5: P54.PAD1 64,92.4 64,272.4 65.2,273.6 65.2,277.21 HEADER_3.23
BUS-55
  Bottom 0.5: P55.PAD1 45.7,92.4 45.7,266.9 40.5,272.1 40.5,277.25 HEADER_4.5
BUS-56
  Bottom 0.5: P56.PAD1 27.4,92.4 27.4,258.1 17.7,267.8 17.7,277.21 HEADER_4.23
BUS-57
  Bottom 0.5: P57.PAD1 157.65,103.25 157.1,103.8 157.1,225.4 185.1,253.4 185.1,277.21 HEADER_1.3
BUS-58
  Bottom 0.5: P58.PAD1 139.45,103.25 138.8,103.9 138.8,236.7 162.1,260 162.1,277.17 HEADER_1.21
BUS-59
  Bottom 0.5: P59.PAD1 121.15,103.25 120.5,103.9 120.5,247.3 138,264.8 138,277.21 HEADER_2.3
BUS-60
  Bottom 0.5: P60.PAD1 102.75,103.25 102.2,103.8 102.2,256.6 115.2,269.6 115.2,277.25 HEADER_2.21
BUS-61
  Bottom 0.5: P61.PAD1 84.45,103.25 83.9,103.8 83.9,265.7 90.6,272.4 90.6,277.21 HEADER_3.3
BUS-62
  Bottom 0.5: P62.PAD1 66.15,103.25 65.6,103.8 65.6,271.2 67.7,273.3 67.7,277.25 HEADER_3.21
BUS-63
  Bottom 0.5: P63.PAD1 47.85,103.25 47.3,103.8 47.3,268.1 43.1,272.3 43.1,277.21 HEADER_4.3
BUS-64
  Bottom 0.5: P64.PAD1 29.55,103.25 29,103.8 29,259.3 20.2,268.1 20.2,277.25 HEADER_4.21
BUS-65
  Bottom 0.5: P65.PAD1 158.7,117.2 158.7,224.2 187.6,253.1 187.6,277.25 HEADER_1.1
BUS-66
  Bottom 0.5: P66.PAD1 140.4,117.2 140.4,235.5 164.7,259.8 164.7,277.23 HEADER_1.19
BUS-67
  Bottom 0.5: P67.PAD1 122.1,117.2 122.1,246.1 140.6,264.6 140.6,277.25 HEADER_2.1
BUS-68
  Bottom 0.5: P68.PAD1 103.8,117.2 103.8,255.4 117.7,269.3 117.7,277.23 HEADER_2.19
BUS-69
  Bottom 0.5: P69.PAD1 85.5,117.2 85.5,264.5 93.1,272.1 93.1,277.25 HEADER_3.1
BUS-70
  Bottom 0.5: P70.PAD1 67.2,117.2 67.2,269.8 70.3,272.9 70.3,277.19 HEADER_3.19
BUS-71
  Bottom 0.5: P71.PAD1 48.9,117.2 48.9,269.3 45.6,272.6 45.6,277.25 HEADER_4.1
BUS-72
  Bottom 0.5: P72.PAD1 30.6,117.2 30.6,260.5 22.8,268.3 22.8,277.19 HEADER_4.19